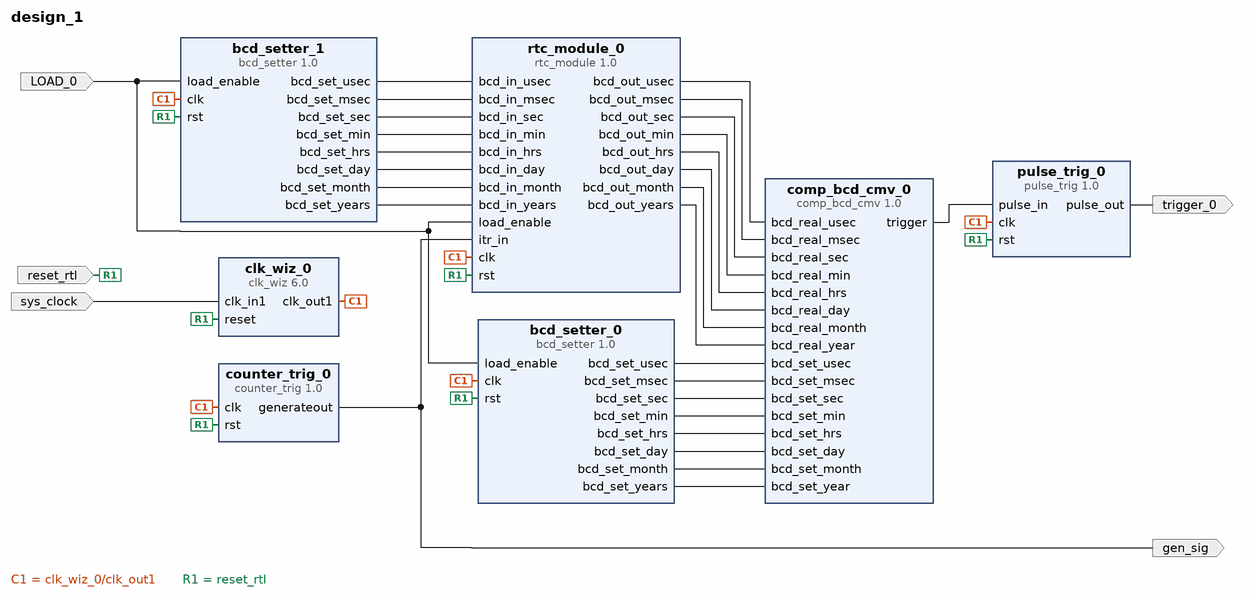
[diagram p0: block diagram of the top level]
# Vivado block design design_1, xc7z007sclg400-1, Vivado 2020.2
create_bd_design design_1

create_bd_port -dir I -type rst reset_rtl
set_property -dict {CONFIG.POLARITY ACTIVE_HIGH} [get_bd_ports reset_rtl]
create_bd_port -dir O trigger_0
create_bd_port -dir I -type data LOAD_0
create_bd_port -dir O gen_sig
create_bd_port -dir I -type clk sys_clock
set_property -dict {CONFIG.FREQ_HZ 125000000 CONFIG.PHASE 0.000} [get_bd_ports sys_clock]

create_bd_cell -type ip -vlnv xilinx.com:user:rtc_module:1.0 rtc_module_0
set_property -dict {CONFIG.RESET_EDGE {"1"}} [get_bd_cells rtc_module_0]
create_bd_cell -type ip -vlnv xilinx.com:user:bcd_setter:1.0 bcd_setter_0
set_property -dict [list \
  CONFIG.DAY_1 {"0111"} \
  CONFIG.DAY_2 {"01"} \
  CONFIG.HRS_1 {"0101"} \
  CONFIG.HRS_2 {"01"} \
  CONFIG.MIN_1 {"0000"} \
  CONFIG.MIN_2 {"101"} \
  CONFIG.MONTH_1 {"0101"} \
  CONFIG.M_SEC_2 {"0000"} \
  CONFIG.M_SEC_3 {"0000"} \
  CONFIG.RESET_EDGE {"1"} \
  CONFIG.SEC_1 {"0000"} \
  CONFIG.SEC_2 {"000"} \
  CONFIG.U_SEC_1 {"0000"} \
  CONFIG.U_SEC_2 {"0000"} \
  CONFIG.U_SEC_3 {"0000"} \
  CONFIG.YEARS_1 {"0001"} \
  CONFIG.YEARS_2 {"0010"} \
] [get_bd_cells bcd_setter_0]
create_bd_cell -type ip -vlnv xilinx.com:user:bcd_setter:1.0 bcd_setter_1
set_property -dict [list \
  CONFIG.DAY_1 {"0111"} \
  CONFIG.DAY_2 {"01"} \
  CONFIG.HRS_1 {"0101"} \
  CONFIG.HRS_2 {"01"} \
  CONFIG.MIN_1 {"0000"} \
  CONFIG.MIN_2 {"100"} \
  CONFIG.MONTH_1 {"0101"} \
  CONFIG.M_SEC_2 {"0000"} \
  CONFIG.M_SEC_3 {"0000"} \
  CONFIG.RESET_EDGE {"1"} \
  CONFIG.SEC_1 {"0000"} \
  CONFIG.SEC_2 {"000"} \
  CONFIG.U_SEC_1 {"0000"} \
  CONFIG.U_SEC_2 {"0000"} \
  CONFIG.U_SEC_3 {"0000"} \
  CONFIG.YEARS_1 {"0001"} \
  CONFIG.YEARS_2 {"0010"} \
] [get_bd_cells bcd_setter_1]
create_bd_cell -type ip -vlnv xilinx.com:ip:clk_wiz:6.0 clk_wiz_0
set_property -dict [list \
  CONFIG.CLKOUT1_JITTER 143.688 \
  CONFIG.CLKOUT1_REQUESTED_OUT_FREQ 50.000 \
  CONFIG.CLK_IN1_BOARD_INTERFACE sys_clock \
  CONFIG.MMCM_CLKOUT0_DIVIDE_F 20.000 \
  CONFIG.USE_BOARD_FLOW true \
] [get_bd_cells clk_wiz_0]
create_bd_cell -type ip -vlnv xilinx.com:user:pulse_trig:1.0 pulse_trig_0
set_property -dict {CONFIG.PULSE_WIDTH 100000000} [get_bd_cells pulse_trig_0]
create_bd_cell -type ip -vlnv xilinx.com:user:comp_bcd_cmv:1.0 comp_bcd_cmv_0
create_bd_cell -type ip -vlnv xilinx.com:user:counter_trig:1.0 counter_trig_0

# ---- connections ----

connect_bd_net [get_bd_pins rtc_module_0/bcd_out_usec] [get_bd_pins comp_bcd_cmv_0/bcd_real_usec]
connect_bd_net [get_bd_pins rtc_module_0/bcd_out_msec] [get_bd_pins comp_bcd_cmv_0/bcd_real_msec]
connect_bd_net [get_bd_pins rtc_module_0/bcd_out_sec] [get_bd_pins comp_bcd_cmv_0/bcd_real_sec]
connect_bd_net [get_bd_pins rtc_module_0/bcd_out_min] [get_bd_pins comp_bcd_cmv_0/bcd_real_min]
connect_bd_net [get_bd_pins rtc_module_0/bcd_out_hrs] [get_bd_pins comp_bcd_cmv_0/bcd_real_hrs]
connect_bd_net [get_bd_pins rtc_module_0/bcd_out_day] [get_bd_pins comp_bcd_cmv_0/bcd_real_day]
connect_bd_net [get_bd_pins rtc_module_0/bcd_out_month] [get_bd_pins comp_bcd_cmv_0/bcd_real_month]
connect_bd_net [get_bd_pins rtc_module_0/bcd_out_years] [get_bd_pins comp_bcd_cmv_0/bcd_real_year]
connect_bd_net -net axi_timer_0_generateout0 [get_bd_pins counter_trig_0/generateout] [get_bd_pins rtc_module_0/itr_in] [get_bd_ports gen_sig]
connect_bd_net [get_bd_pins bcd_setter_0/bcd_set_usec] [get_bd_pins comp_bcd_cmv_0/bcd_set_usec]
connect_bd_net [get_bd_pins bcd_setter_0/bcd_set_msec] [get_bd_pins comp_bcd_cmv_0/bcd_set_msec]
connect_bd_net [get_bd_pins bcd_setter_0/bcd_set_sec] [get_bd_pins comp_bcd_cmv_0/bcd_set_sec]
connect_bd_net [get_bd_pins bcd_setter_0/bcd_set_min] [get_bd_pins comp_bcd_cmv_0/bcd_set_min]
connect_bd_net [get_bd_pins bcd_setter_0/bcd_set_hrs] [get_bd_pins comp_bcd_cmv_0/bcd_set_hrs]
connect_bd_net [get_bd_pins bcd_setter_0/bcd_set_day] [get_bd_pins comp_bcd_cmv_0/bcd_set_day]
connect_bd_net [get_bd_pins bcd_setter_0/bcd_set_month] [get_bd_pins comp_bcd_cmv_0/bcd_set_month]
connect_bd_net [get_bd_pins bcd_setter_0/bcd_set_years] [get_bd_pins comp_bcd_cmv_0/bcd_set_year]
connect_bd_net -net LOAD_0_1 [get_bd_ports LOAD_0] \
  [get_bd_pins rtc_module_0/load_enable] [get_bd_pins bcd_setter_0/load_enable] [get_bd_pins bcd_setter_1/load_enable]
connect_bd_net [get_bd_pins bcd_setter_1/bcd_set_usec] [get_bd_pins rtc_module_0/bcd_in_usec]
connect_bd_net [get_bd_pins bcd_setter_1/bcd_set_msec] [get_bd_pins rtc_module_0/bcd_in_msec]
connect_bd_net [get_bd_pins bcd_setter_1/bcd_set_sec] [get_bd_pins rtc_module_0/bcd_in_sec]
connect_bd_net [get_bd_pins bcd_setter_1/bcd_set_min] [get_bd_pins rtc_module_0/bcd_in_min]
connect_bd_net [get_bd_pins bcd_setter_1/bcd_set_hrs] [get_bd_pins rtc_module_0/bcd_in_hrs]
connect_bd_net [get_bd_pins bcd_setter_1/bcd_set_day] [get_bd_pins rtc_module_0/bcd_in_day]
connect_bd_net [get_bd_pins bcd_setter_1/bcd_set_month] [get_bd_pins rtc_module_0/bcd_in_month]
connect_bd_net [get_bd_pins bcd_setter_1/bcd_set_years] [get_bd_pins rtc_module_0/bcd_in_years]
connect_bd_net [get_bd_pins comp_bcd_cmv_0/trigger] [get_bd_pins pulse_trig_0/pulse_in]
connect_bd_net [get_bd_pins pulse_trig_0/pulse_out] [get_bd_ports trigger_0]
connect_bd_net [get_bd_ports sys_clock] [get_bd_pins clk_wiz_0/clk_in1]
connect_bd_net [get_bd_pins clk_wiz_0/clk_out1] \
  [get_bd_pins pulse_trig_0/clk] [get_bd_pins bcd_setter_0/clk] [get_bd_pins rtc_module_0/clk] [get_bd_pins bcd_setter_1/clk] \
  [get_bd_pins counter_trig_0/clk]
connect_bd_net [get_bd_ports reset_rtl] \
  [get_bd_pins pulse_trig_0/rst] [get_bd_pins bcd_setter_0/rst] [get_bd_pins rtc_module_0/rst] [get_bd_pins clk_wiz_0/reset] \
  [get_bd_pins bcd_setter_1/rst] [get_bd_pins counter_trig_0/rst]

validate_bd_design
save_bd_design
